# EAGLE design SEGMENTOVKA_I2C (EAGLE 7.7.0)
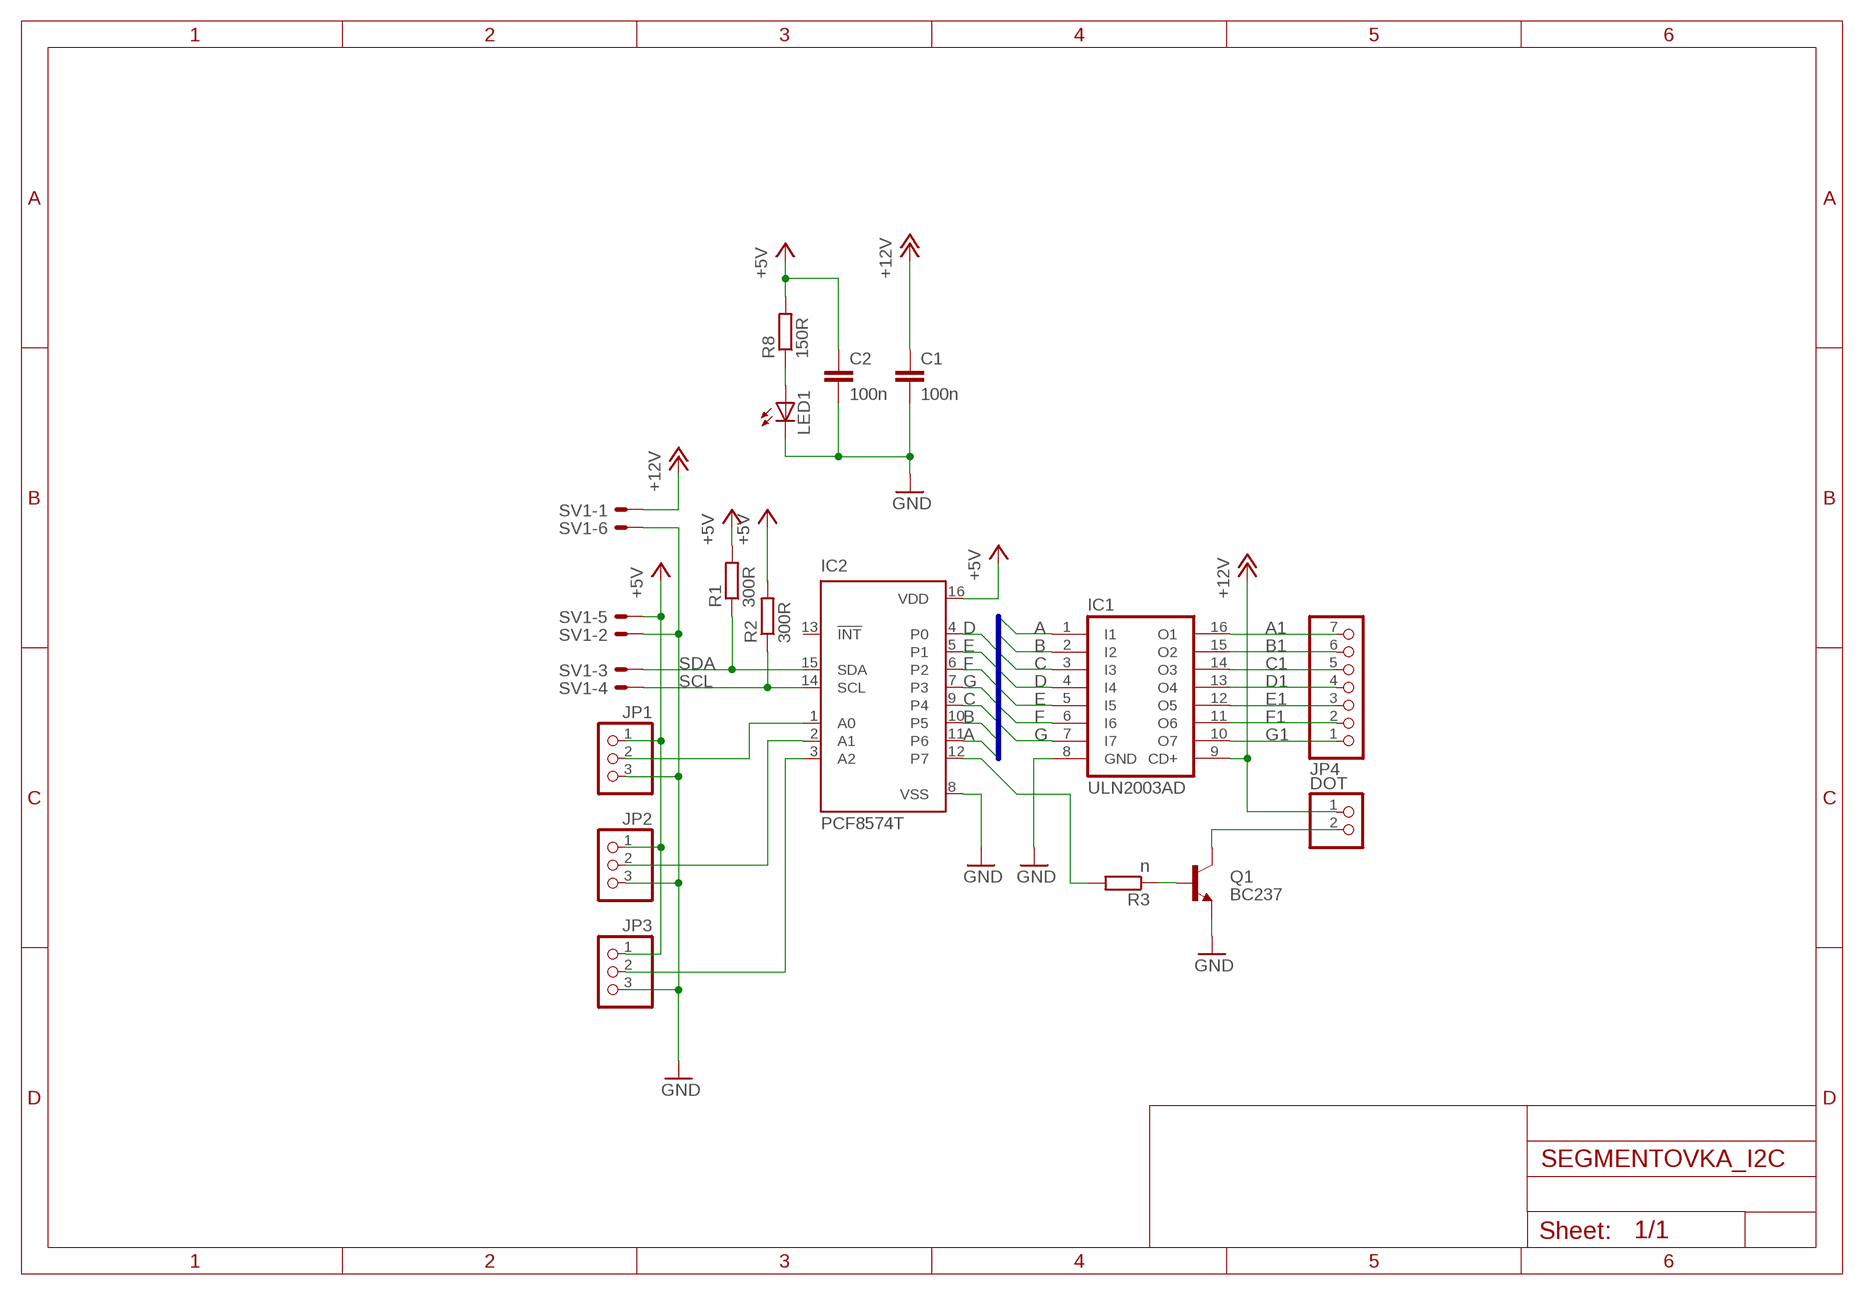
[diagram p0: schematic, sheet 1]

## Parts
C1  100n  C-EUC0603  [C0603]
C2  100n  C-EUC0603  [C0603]
DOT  PINHD-1X2  [1X02]
IC1  ULN2003AD  [SO16]
IC2  PCF8574T  [SO16W]
JP1  PINHD-1X3  [1X03]
JP2  PINHD-1X3  [1X03]
JP3  PINHD-1X3  [1X03]
JP4  PINHD-1X7  [1X07]
LED1  LEDCHIP-LED0603  [CHIP-LED0603]
Q1  BC237  [TO92]
R1  300R  R-EU_R0603  [R0603]
R2  300R  R-EU_R0603  [R0603]
R3  n  R-EU_R0603  [R0603]
R8  150R  R-EU_R0603  [R0603]
SV1  ML6E  [ML6]

## Nets
+5V: C2.1 IC2.16(VDD) JP1.1 JP2.1 JP3.1 R1.2 R2.2 R8.2 SV1.5
+12V: C1.1 DOT.1 IC1.9(CD+) SV1.1
A: IC1.1(I1) IC2.11(P6)
A1: IC1.16(O1) JP4.7
B: IC1.2(I2) IC2.10(P5)
B1: IC1.15(O2) JP4.6
C: IC1.3(I3) IC2.9(P4)
C1: IC1.14(O3) JP4.5
D: IC1.4(I4) IC2.4(P0)
D1: IC1.13(O4) JP4.4
E: IC1.5(I5) IC2.5(P1)
E1: IC1.12(O5) JP4.3
F: IC1.6(I6) IC2.6(P2)
F1: IC1.11(O6) JP4.2
G: IC1.7(I7) IC2.7(P3)
G1: IC1.10(O7) JP4.1
GND: C1.2 C2.2 IC1.8(GND) IC2.8(VSS) JP1.3 JP2.3 JP3.3 LED1.C Q1.1(E) SV1.2 SV1.6
N$1: DOT.2 Q1.3(C)
N$2: Q1.2(B) R3.1
N$3: IC2.12(P7) R3.2
N$23: IC2.1(A0) JP1.2
N$24: IC2.2(A1) JP2.2
N$25: IC2.3(A2) JP3.2
N$28: LED1.A R8.1
SCL: IC2.14(SCL) R2.1 SV1.4
SDA: IC2.15(SDA) R1.1 SV1.3
Unconnected: IC2.13(!INT)

## Buses
B$1,A,B,C,D,E,F,G

## Library data of the parts
C1 C2 = rcl:C-EU: CAPACITOR, European symbol
DOT = pinhead:PINHD-1X2: PIN HEADER
IC1 = uln-udn:ULN2003A: DRIVER ARRAY
IC2 = micro-philips:PCF8574: I2C-Bus Remote 8-bit I/O expander http://www.semiconductors.philips.com/acrobat_download/datasheets/PCF8574_4.pdf; MPN: PCF8574T/3,512; OC_FARNELL: 1201255; OC_NEWARK: 70R6870
JP1-JP3 = pinhead:PINHD-1X3: PIN HEADER
JP4 = pinhead:PINHD-1X7: PIN HEADER
LED1 = led:LED: LED OSRAM: - CHIPLED LG R971, LG N971, LY N971, LG Q971, LY Q971, LO R971, LY R971 LH N974, LH R974 LS Q976, LO Q976, LY Q976 LO Q996 - Hyper CHIPLED LW Q18S LB Q993, LB Q99A, LB R99A - SideLED LS A670, LO A670, LY A670, LG A670, LP A670 LB A673, LV A673, LT A673, LW A673 LH A674 LY A675 LS A676, LA A676, LO A676, LY A676, LW A676 LS A679, LY A679, LG A679 - Hyper Micro SIDELED® LS Y876, LA Y876, LO Y876, LY Y876 LT Y87S - SmartLED LW L88C, LW L88S LB L89C, LB L89S, LG L890 LS L89K, LO L89K, LY L89K LS L896, LA L896, LO L896, LY L896 - TOPLED LS T670, LO T670, LY T670, LG T670, LP T670 LSG T670, LSP T670, LSY T670, LOP T670, LYG T670 LG T671, LOG T671, LSG T671 LB T673, LV T673, LT T673, LW T673 LH T674 LS T676, LA T676, LO T676, LY T676, LB T676, LH T676, LSB T676, LW T676 LB T67C, LV T67C, LT T67C, LS T67K, LO T67K, LY T67K, LW E67C LS E67B, LA E67B, LO E67B, LY E67B, LB E67C, LV E67C, LT E67C LW T67C LS T679, LY T679, LG T679 LS T770, LO T770, LY T770, LG T770, LP T770 LB T773, LV T773, LT T773, LW T773 LH T774 LS E675, LA E675, LY E675, LS T675 LS T776, LA T776, LO T776, LY T776, LB T776 LHGB T686 LT T68C, LB T68C - Hyper Mini TOPLED® LB M676 - Mini TOPLED Santana® LG M470 LS M47K, LO M47K, LY M47K Source: http://www.osram.convergy.de LUXEON: - LUMILED® LXK2-PW12-R00, LXK2-PW12-S00, LXK2-PW14-U00, LXK2-PW14-V00 LXK2-PM12-R00, LXK2-PM12-S00, LXK2-PM14-U00 LXK2-PE12-Q00, LXK2-PE12-R00, LXK2-PE12-S00, LXK2-PE14-T00, LXK2-PE14-U00 LXK2-PB12-K00, LXK2-PB12-L00, LXK2-PB12-M00, LXK2-PB14-N00, LXK2-PB14-P00, LXK2-PB14-Q00 LXK2-PR12-L00, LXK2-PR12-M00, LXK2-PR14-Q00, LXK2-PR14-R00 LXK2-PD12-Q00, LXK2-PD12-R00, LXK2-PD12-S00 LXK2-PH12-R00, LXK2-PH12-S00 LXK2-PL12-P00, LXK2-PL12-Q00, LXK2-PL12-R00 Source: www.luxeon.com KINGBRIGHT: KA-3528ASYC Source: www.kingbright.com
Q1 = transistor-npn:BC237: NPN Transistor
R1-R3 R8 = rcl:R-EU_: RESISTOR, European symbol
SV1 = con-ml:ML6E: HARTING; OC_FARNELL: unknown; OC_NEWARK: unknown

## Board
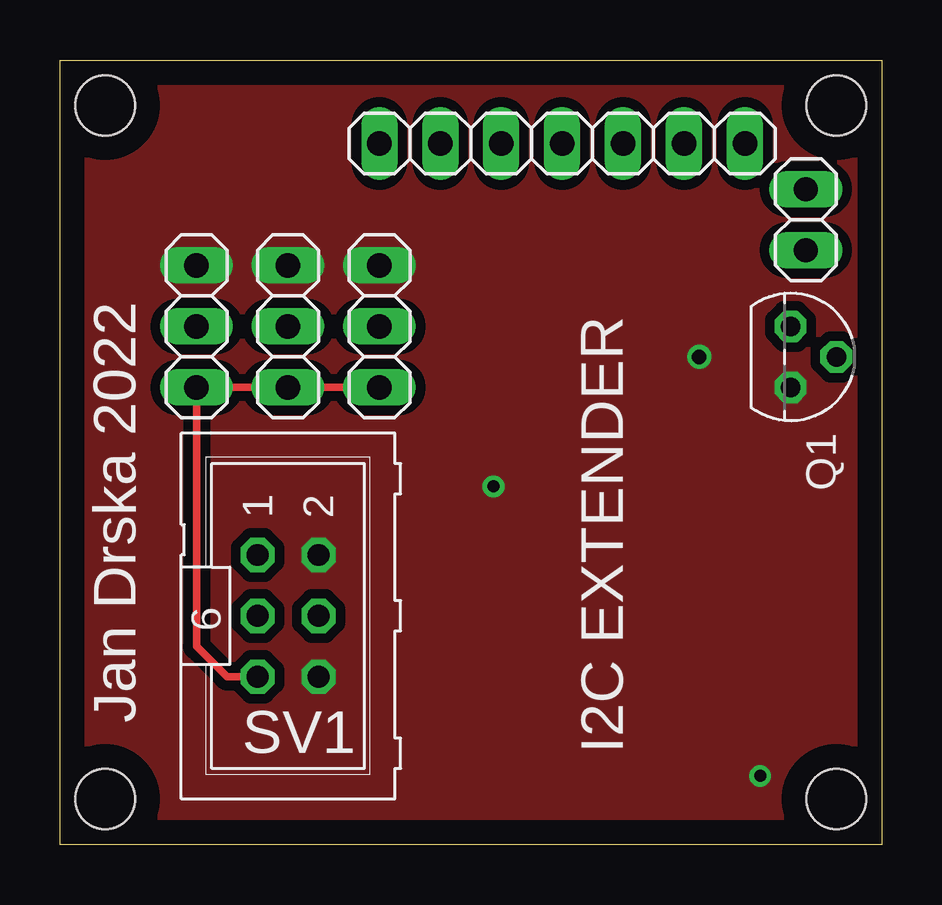
[diagram p1: board, top side]
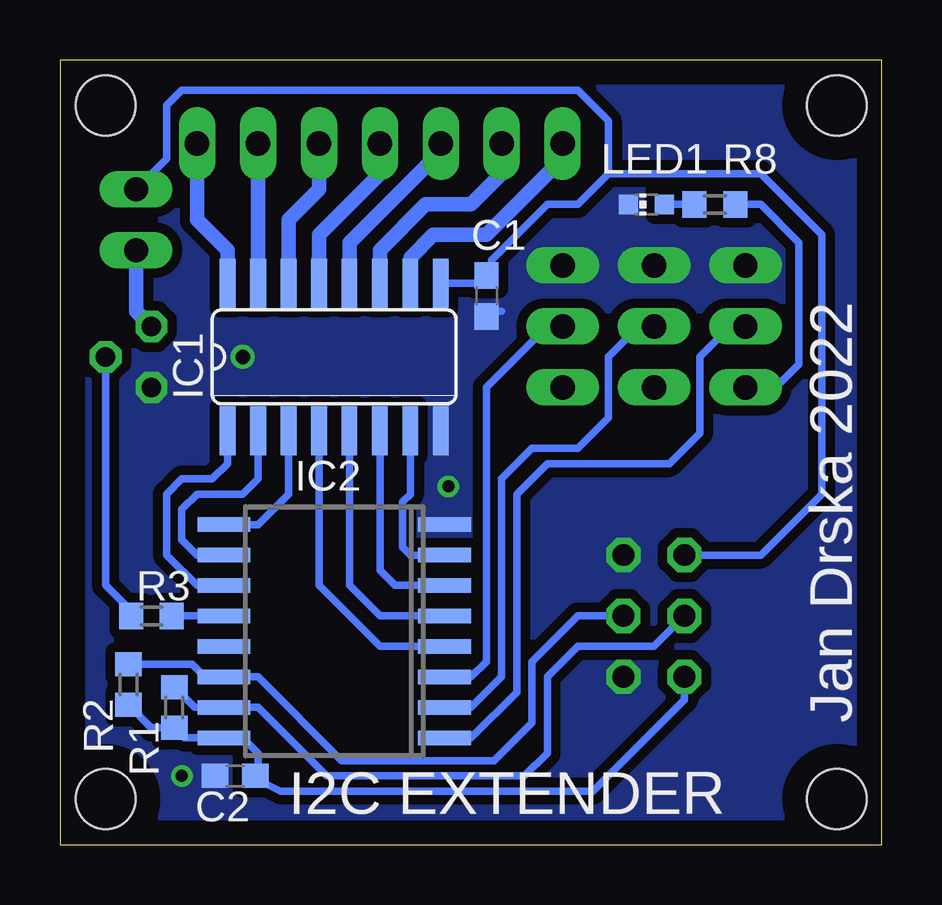
[diagram p2: board, bottom side, seen from below]

Size 34.27 x 32.69 mm. Coordinates in mm from the lower left corner, seen from the top.
Outline: 34.27,0 0,0 0,32.69 34.27,32.69 34.27,0
Copper layers (1*16): Top 0.035mm / dielectric 1.5mm / Bottom 0.035mm
Design rules "default": minimum track width 10mil, minimum drill 24mil, track to track 8mil, track to pad 8mil, pad to pad 8mil, via to via 8mil, smd to smd 8mil, copper to edge 40mil, drill to drill 8mil, minimum pad ring 10mil, minimum via ring 8mil, stop-mask expansion 4mil, vias tented up to drill 0mil, thermal gap 10mil
Holes 2.5 mm at 32.36,30.8 1.89,1.91 1.89,30.8 32.36,1.91

### Footprints (pad centres in the part's own frame; a part is rotated, then mirrored left to right if it is on the bottom)
C0603 = smd 1.1 x 1: 1 -0.85,0; 2 0.85,0
1X02 = drill 1.016 long: 1 -1.27,0; 2 1.27,0
SO16 = smd 0.66 x 2.032: 1 -4.445,-3.073; 2 -3.175,-3.073; 3 -1.905,-3.073; 4 -0.635,-3.073; 5 0.635,-3.073; 6 1.905,-3.073; 7 3.175,-3.073; 8 4.445,-3.073; 9 4.445,3.073; 10 3.175,3.073; 11 1.905,3.073; 12 0.635,3.073; 13 -0.635,3.073; 14 -1.905,3.073; 15 -3.175,3.073; 16 -4.445,3.073
SO16W = smd 0.6 x 2.2: 1 -4.445,-4.6; 2 -3.175,-4.6; 3 -1.905,-4.6; 4 -0.635,-4.6; 5 0.635,-4.6; 6 1.905,-4.6; 7 3.175,-4.6; 8 4.445,-4.6; 9 4.445,4.6; 10 3.175,4.6; 11 1.905,4.6; 12 0.635,4.6; 13 -0.635,4.6; 14 -1.905,4.6; 15 -3.175,4.6; 16 -4.445,4.6
1X03 = drill 1.016 long: 1 -2.54,0; 2 0,0; 3 2.54,0
1X07 = drill 1.016 long: 1 -7.62,0; 2 -5.08,0; 3 -2.54,0; 4 0,0; 5 2.54,0; 6 5.08,0; 7 7.62,0
CHIP-LED0603 = smd 0.8 x 0.8: A 0,-0.75; C 0,0.75
TO92 = drill 0.813 octagon: 1 1.27,0; 2 0,1.905; 3 -1.27,0
R0603 = smd 1 x 1.1: 1 -0.85,0; 2 0.85,0
ML6 = drill 0.914 octagon: 1 -2.54,-1.27; 2 -2.54,1.27; 3 0,-1.27; 4 0,1.27; 5 2.54,-1.27; 6 2.54,1.27

### Placement (x,y rotation side)
C1  16.49,22.86 270 bottom
C2  26.97,2.86 180 bottom
DOT  31.09,26.04 270 top
IC1  22.84,20.32 0 bottom
IC2  22.84,8.89 90 bottom
JP1  5.7,21.59 90 top
JP2  9.51,21.59 90 top
JP3  13.32,21.59 90 top
JP4  20.93,29.21 0 top
LED1  9.82,26.67 90 bottom
Q1  30.46,20.32 270 top
R1  29.51,5.71 270 bottom
R2  31.41,6.67 270 bottom
R3  30.46,9.53 0 bottom
R8  6.97,26.67 0 bottom
SV1  9.51,9.53 270 top

### Tracks (layer width: path | path; a pad name or v marks a point on that pad's centre or on a via)
+5V
  Top 0.305: JP3.1 JP2.1 JP1.1 5.7,8.26 6.97,6.99 SV1.5
  Bottom 0.305: R8.2 5.06,26.67 3.47,25.08 3.47,20 4.43,19.05 JP1.1 | R2.2 30.46,4.87 R1.2 29.09,4.45 IC2.16 26.65,4.45 26.02,3.81 26.02,2.75 C2.1 25.91,2.86 25.7,2.54 25.06,2.22 12.04,2.22 8.24,6.03 SV1.5
+12V
  Bottom 0.305: IC1.9 16.81,23.39 C1.1 16.28,23.5 16.28,24.34 13.95,26.67 12.68,26.67 11.41,27.94 | 11.41,27.94 5.06,27.94 2.52,25.4 2.52,14.61 5.06,12.06 SV1.1 | DOT.1 29.82,28.57 29.82,30.8 29.19,31.43 12.68,31.43 11.41,30.16 11.41,27.94
A
  Bottom 0.305: IC2.11 28.55,10.79 29.82,12.06 29.82,14.61 29.19,15.24 27.92,15.24 27.29,15.88 IC1.1
A1
  Bottom 0.61: IC1.16 27.29,24.77 28.55,26.04 JP4.7
B
  Bottom 0.305: IC2.10 28.55,12.06 29.19,12.7 29.19,13.97 28.55,14.61 26.65,14.61 26.02,15.24 IC1.2
B1
  Bottom 0.61: IC1.15 JP4.6
C
  Bottom 0.305: IC1.3 24.75,14.61 26.02,13.34 IC2.9
C1
  Bottom 0.61: IC1.14 24.75,26.04 23.48,27.3 JP4.5
D
  Bottom 0.305: IC2.4 20.93,8.26 23.48,10.79 IC1.4
D1
  Bottom 0.61: IC1.13 23.48,25.4 20.93,27.94 JP4.4
E
  Bottom 0.305: IC2.5 20.93,9.53 22.21,10.79 IC1.5
E1
  Bottom 0.61: IC1.12 22.21,25.08 18.39,28.89 JP4.3
F
  Bottom 0.305: IC2.6 20.3,10.79 20.93,11.43 IC1.6
F1
  Bottom 0.61: IC1.11 20.93,24.77 19.03,26.67 17.12,26.67 15.86,27.94 JP4.2
G
  Bottom 0.305: IC1.7 19.66,14.61 19.98,14.29 19.98,12.38 19.66,12.06 IC2.7
G1
  Bottom 0.61: IC1.10 19.66,24.45 18.71,25.4 16.49,25.4 13.32,28.57 JP4.1
GND  (via drill 0.5, 0.6)
  Top 0.305: JP3.3 13.95,24.13
  Bottom 0.305: 15.86,22.23 16.28,22.23 C1.2
  other vias: 18.08,14.92 29.19,2.86 26.65,20.32
  pour Bottom (isolate 0.406, no thermals): 34.27,32.7 -0.02,32.7 -0.02,0 34.27,0
  pour Top (isolate 0.406, no thermals): 34.27,32.7 -0.02,32.7 -0.02,0 34.27,0
N$1
  Bottom 0.61: DOT.2 31.09,22.23 Q1.3
N$2
  Bottom 0.305: R3.1 31.31,9.74 32.36,10.79 Q1.2
N$3
  Bottom 0.305: IC2.12 R3.2
N$23
  Bottom 0.305: IC2.1 17.12,4.45 15.22,6.35 15.22,14.61 13.95,15.88 8.87,15.88 7.6,17.14 7.6,20.32 6.33,21.59 JP1.2
N$24
  Bottom 0.305: IC2.2 17.12,5.71 15.86,6.99 15.86,15.24 14.59,16.51 12.68,16.51 11.41,17.78 11.41,20.32 10.14,21.59 JP2.2
N$25
  Bottom 0.305: IC2.3 17.12,6.99 16.49,7.62 16.49,19.05 13.95,21.59 JP3.2
N$28
  Bottom 0.305: LED1.A R8.1
SCL
  Bottom 0.305: R2.1 28.77,7.52 28.24,6.99 IC2.14 26.02,6.99 22.52,3.49 16.17,3.49 14.59,5.08 14.59,7.62 12.68,9.53 SV1.4
SDA
  Bottom 0.305: R1.1 28.66,5.71 IC2.15 26.02,5.71 23.16,2.86 14.9,2.86 13.95,3.81 13.95,6.99 12.68,8.26 9.51,8.26 SV1.3

### Text on the board
tNames: Jan Drska 2022 | I2C EXTENDER
bNames: Jan Drska 2022 | I2C EXTENDER